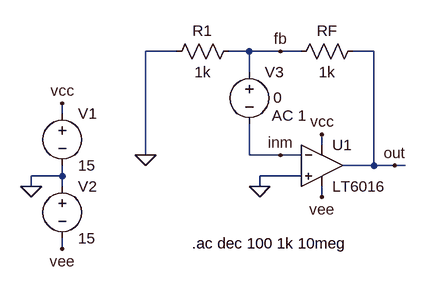
[diagram p0: schematic 01-open_loop_stability_lt6016.asc]
* 01-open_loop_stability_lt6016.asc
V1 vcc 0 15
V2 0 vee 15
R1 fb 0 1k
RF out fb 1k
* U1: LT6016 (symbol OpAmps\LT6016 not available, pins judged from their places): In+=0 In-=inm V+=vcc V-=vee OUT=out
V3 fb inm 0 AC 1
.ac dec 100 1k 10meg
.backanno
.end

* Results of the author's LTspice run, read from the files saved beside the schematic
* Operating Point, zero values left out:
*   V(vcc) = 15 V
*   V(vee) = -15 V
*   V(fb) = -20.2 nV
*   V(out) = 1.727 µV
*   V(inm) = -20.2 nV
*   I(Rf) = 1.747 nA
*   I(R1) = -20.2 pA
*   I(V3) = 1.767 nA
*   I(V2) = -345.9 µA
*   I(V1) = -345.9 µA
*   Ix(u1:1) = 1.767 nA
*   Ix(u1:2) = 1.767 nA
*   Ix(u1:3) = 345.9 µA
*   Ix(u1:4) = -345.9 µA
*   Ix(u1:5) = -1.733 nA
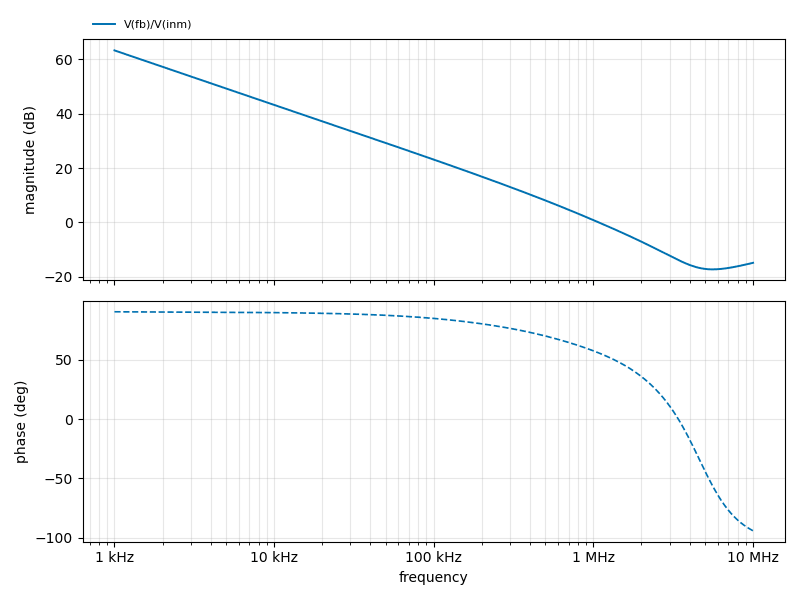
[diagram p1: AC Analysis of 01-open_loop_stability_lt6016.asc, plotted from the saved traces]
* AC Analysis, 1 run:
*   V(fb)/V(inm): 63.21 dB at 1 kHz, -14.82 dB at 10 MHz, peak 63.21 dB at 1 kHz, 3 dB below the peak at 1.414 kHz